# Altium schematic sheet MCU_Power.SchDoc
size 420 x 297 mm; SheetNumber: 3; SheetTotal: 13
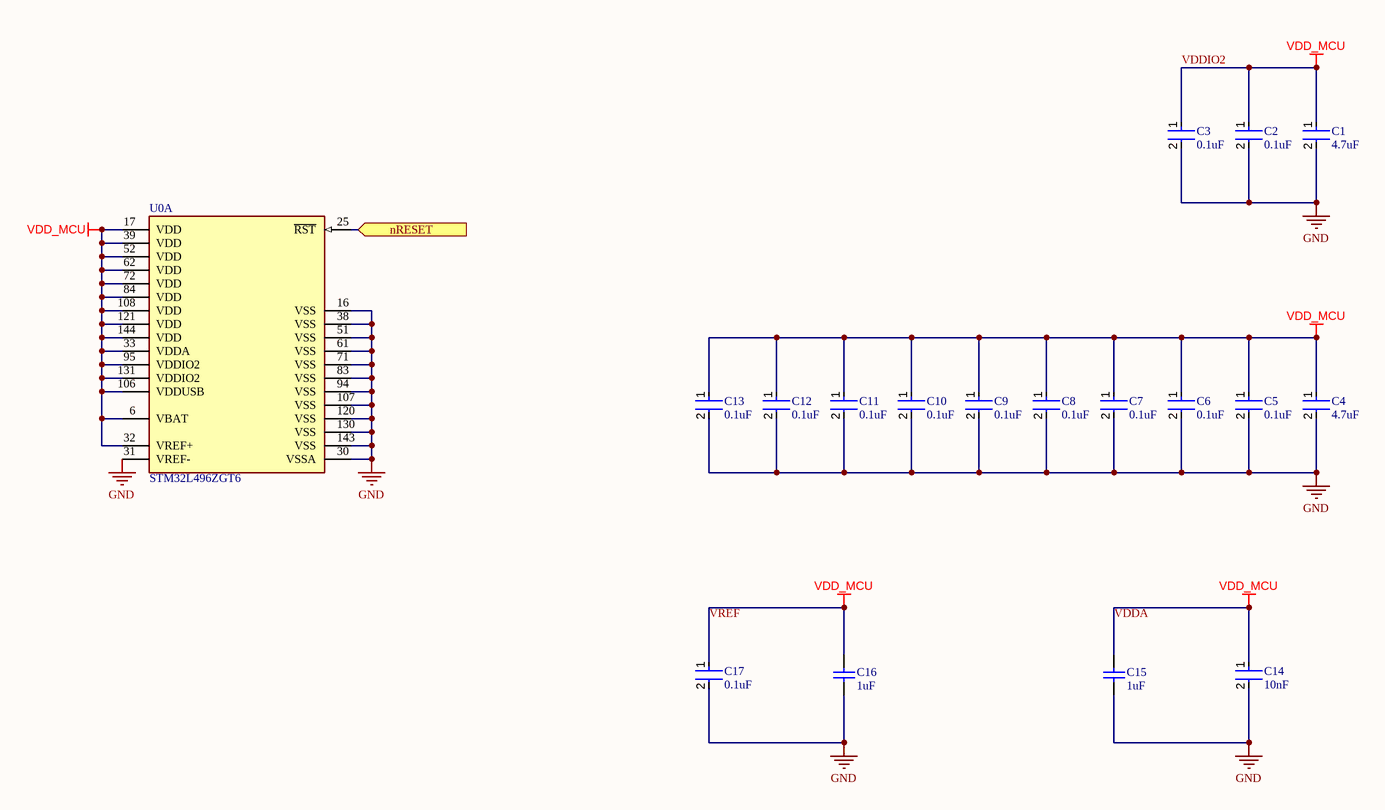
[diagram p0: MCU_Power.SchDoc]

## Parts
C1  4.7uF  [FP-GRM188-0_15-IPC_A]
C2  0.1uF  [FP-C0603C-CF-MFG]
C3  0.1uF  [FP-C0603C-CF-MFG]
C4  4.7uF  [FP-GRM188-0_15-IPC_A]
C5  0.1uF  [FP-C0603C-CF-MFG]
C6  0.1uF  [FP-C0603C-CF-MFG]
C7  0.1uF  [FP-C0603C-CF-MFG]
C8  0.1uF  [FP-C0603C-CF-MFG]
C9  0.1uF  [FP-C0603C-CF-MFG]
C10  0.1uF  [FP-C0603C-CF-MFG]
C11  0.1uF  [FP-C0603C-CF-MFG]
C12  0.1uF  [FP-C0603C-CF-MFG]
C13  0.1uF  [FP-C0603C-CF-MFG]
C14  10nF  [FP-GRM188-0_1-e0_2_0_5-IPC_A]
C15  1uF  [CAPC1608X90X35LL15T15]
C16  1uF  [CAPC1608X90X35LL15T15]
C17  0.1uF  [FP-C0603C-CF-MFG]
U0  STM32L496ZGT6  [FP-LQFP144-1A-MFG]  (part A of 3)

## Ports
nRESET (in)

## Nets
GND: C1.2 C2.2 C3.2 C4.2 C5.2 C6.2 C7.2 C8.2 C9.2 C10.2 C11.2 C12.2 C13.2 C14.2 C15.2 C16.2 C17.2 U0.16(VSS) U0.30(VSSA) U0.31(VREF-) U0.38(VSS) U0.51(VSS) U0.61(VSS) U0.71(VSS) U0.83(VSS) U0.94(VSS) U0.107(VSS) U0.120(VSS) U0.130(VSS) U0.143(VSS)
VDDA: C1.1 C2.1 C3.1 C4.1 C5.1 C6.1 C7.1 C8.1 C9.1 C10.1 C11.1 C12.1 C13.1 C14.1 C15.1 C16.1 C17.1 U0.6(VBAT) U0.17(VDD) U0.32(VREF+) U0.33(VDDA) U0.39(VDD) U0.52(VDD) U0.62(VDD) U0.72(VDD) U0.84(VDD) U0.95(VDDIO2) U0.106(VDDUSB) U0.108(VDD) U0.121(VDD) U0.131(VDDIO2) U0.144(VDD)  [also labelled VDD_MCU, VDDIO2, VREF]
nRESET: U0.25(~{RST}) ; port nRESET

## Notes on the sheet
- THIS DOCUMENT AND THE DATA DISCLOSED HEREIN OR
- HEREWITH IS THE PROPERTY OF ALTIUM LIMITED AND MAY
- DWG NO:
- REVISION
- REV:
- DESCRIPTION
- DATE
- APPROVED
- BE FREELY DISTRIBUTED IN WHOLE. NO RIGHTS ARE
- RESERVED OR EXPRESS OR IMPLIED WARANTEE GIVEN.
- ENG:
- APPROVALS
- PROJECT
- DSN:
- CHK:
- REFERENCE DOCUMENTS
- PROJECT REVISION:
- TITLE
- DOCUMENT REVISION:
- DESIGN ITEM:
- BOM:
- FAB DWG:
- PCB DWG:
- ASSY DWG:
- SCALE:
- A3
- SIZE
- CAGE CODE
- FILE NAME
- DWG NO.
- SHEET
- OF
- REV

## Library data of the parts
C1 C4 = CMP-06035-000034-2: CAP CER 4.7UF 10V X7S 0603; Material: Ceramic; Tolerance: 10%; Height: 0.8mm; Termination: SMD/SMT; Case Code (Metric): 1608; Voltage Rating: 10V; Width: 0.8mm; Resistor Type: Ceramic; Length: 1.6mm; Voltage Rating (DC): 10V; Weight: 0.000222oz; Dielectric: X7S; Package Quantity: 4000; Mount: Surface Mount; Case Code (Imperial): 0603; Case/Package: 0603; Packaging: Tape and Reel; Thickness: 0.037inch; Min Operating Temperature: -55°C; Capacitance: 4.7uF; Max Operating Temperature: 125°C
C2 C3 C5-C13 C17 = CMP-2006-03061-2: CAP CER 0.1UF 50V X7R 0603; Manufacturer: KEMET; Manufacturer Part Number: C0603C104K5RACTU; Tolerance: 0.1; Temperature Coefficient: 30ppm/°C; Material: Ceramic; Automotive Grade: Grade 1; Value: 0.10 μF; Temperature: -55°C to +125°C; RoHS: TRUE; Temperature Range High: +125°C; Lead Free: Yes; Octopart: https://octopart.com/c0603c104k5ractu-kemet-139244; Digikey Description: CAP CER 0.1UF 50V X7R 0603; Category: Cap; Package: C0603C-CF; ComponentLink2Description: Datasheet; Temperature Range Low: -55°C; Device Class L1: Passive Components; Voltage Rating: 50 V; Automotive: Yes; Device Class L3: Ceramic Capacitors; ComponentLink2URL: https://api.kemet.com/component-edge/download/datasheet/C0603C100J5GACAUTO.pdf; Capacitance: 0.10 μF; Device Class L2: Capacitors; Temperature Characteristic: X7R; Height: 0.87mm
C14 = CMP-2006-02943-2: Chip Multilayer Ceramic Capacitors for General Purpose, 0603, 10000pF, X7R, 15%, 10%, 100V; Capacitance: 10nF; Dielectric: X7R; Material: Ceramic; Package Quantity: 4000; Voltage: 100V; Mount: Surface Mount; Min Operating Temperature: -55°C; Thickness: 0.035inch; Height: 0.8mm; Max Operating Temperature: 125°C; Radiation Hardening: No; Lead Free: Lead Free; Case Code (Metric): 1608; REACH SVHC: No SVHC; Termination: SMD/SMT; Tolerance: 10%; Voltage Rating: 100V; Voltage Rating (DC): 100V; Length: 1.6mm; Depth: 0.8mm; Width: 0.031inch; Case Code (Imperial): 0603; Case/Package: 0603; Packaging: Tape and Reel
C15 C16 = CMP-2006-02298-2: Manufacturer: Kemet; Part Number: C0603C105K4RACTU
U0 = CMP-12105-000038-2: IC MCU 32BIT 1MB FLASH 144LQFP; Manufacturer Package Identifier: LQFP144-1A; NexarPartId: 80927210; Number of Channels: 24; Number of I2C Channels: 4; Frequency: 80MHz; Number of USB Channels: 1; Nominal Supply Current: 30nA; Data Bus Width: 32b; Number of Timers/Counters: 2; Number of USART Channels: 3; Max Junction Temperature (Tj): 105°C; Number of I/Os: 115; Number of PWM Channels: 28; Interface: CAN, I2C, I2S, IrDA, LIN, SPI, UART, USART, USB; Core Architecture: ARM Cortex-M4; RAM Size: 320kB; Min Supply Voltage: 1.05V; Max Supply Voltage: 3.6V; Min Operating Temperature: -40°C; RoHS: Non-Compliant; Memory Size: 1MB; Number of A/D Converters: 3; Number of SPI Channels: 3; Max Operating Temperature: 85°C; Memory Type: FLASH; Height: 1.6mm; Ambient Temperature Range High: 85°C; Schedule B: 8542310000, 8542310000; Number of D/A Converters: 2; Number of UART Channels: 2; Lifecycle Status: Production; Flash Memory Size: 1MB; Number of ADC Channels: 24